# EAGLE design LoRa Node Module_V1.0 (EAGLE 9.6.2)
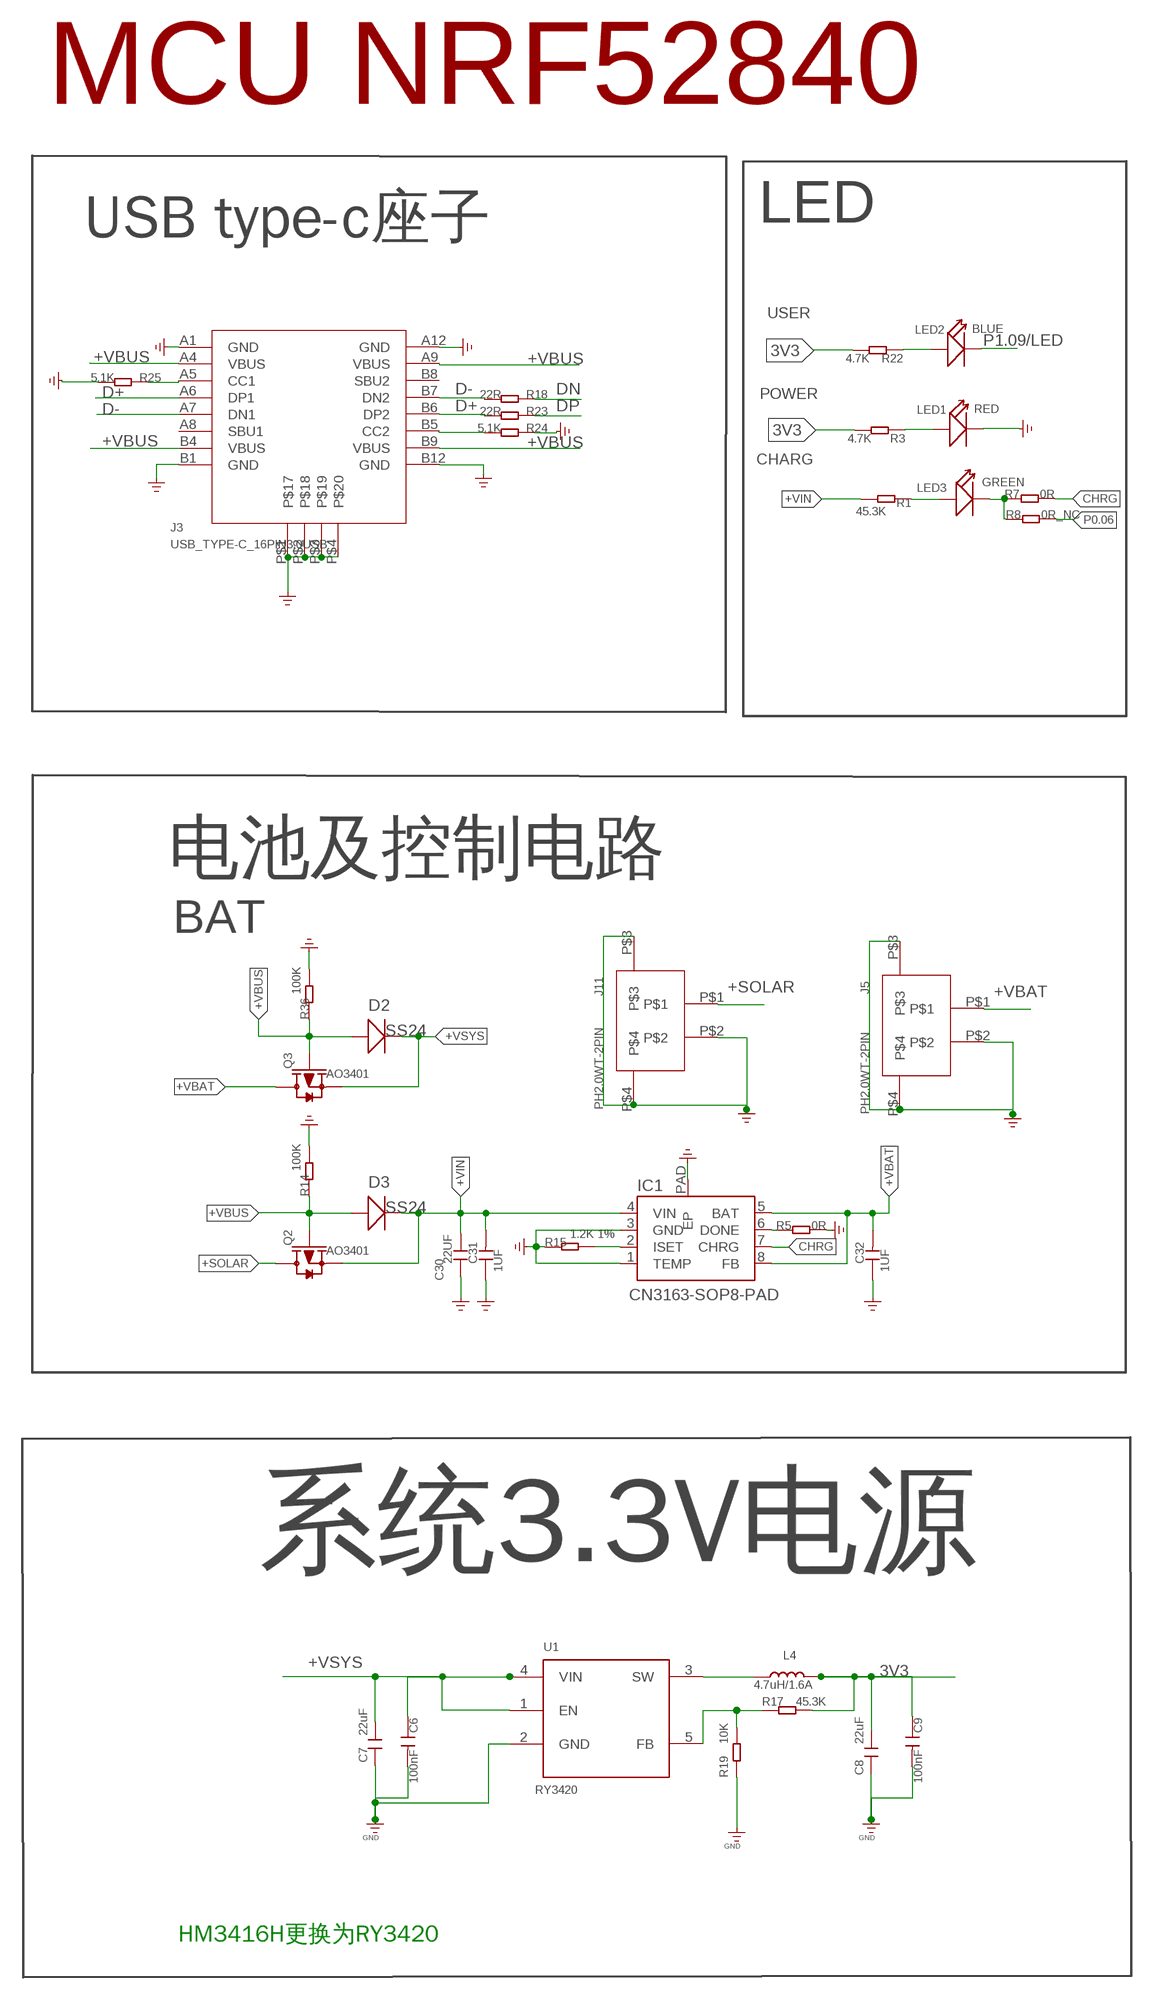
[diagram p0: schematic, sheet 1, part 1 of 2]
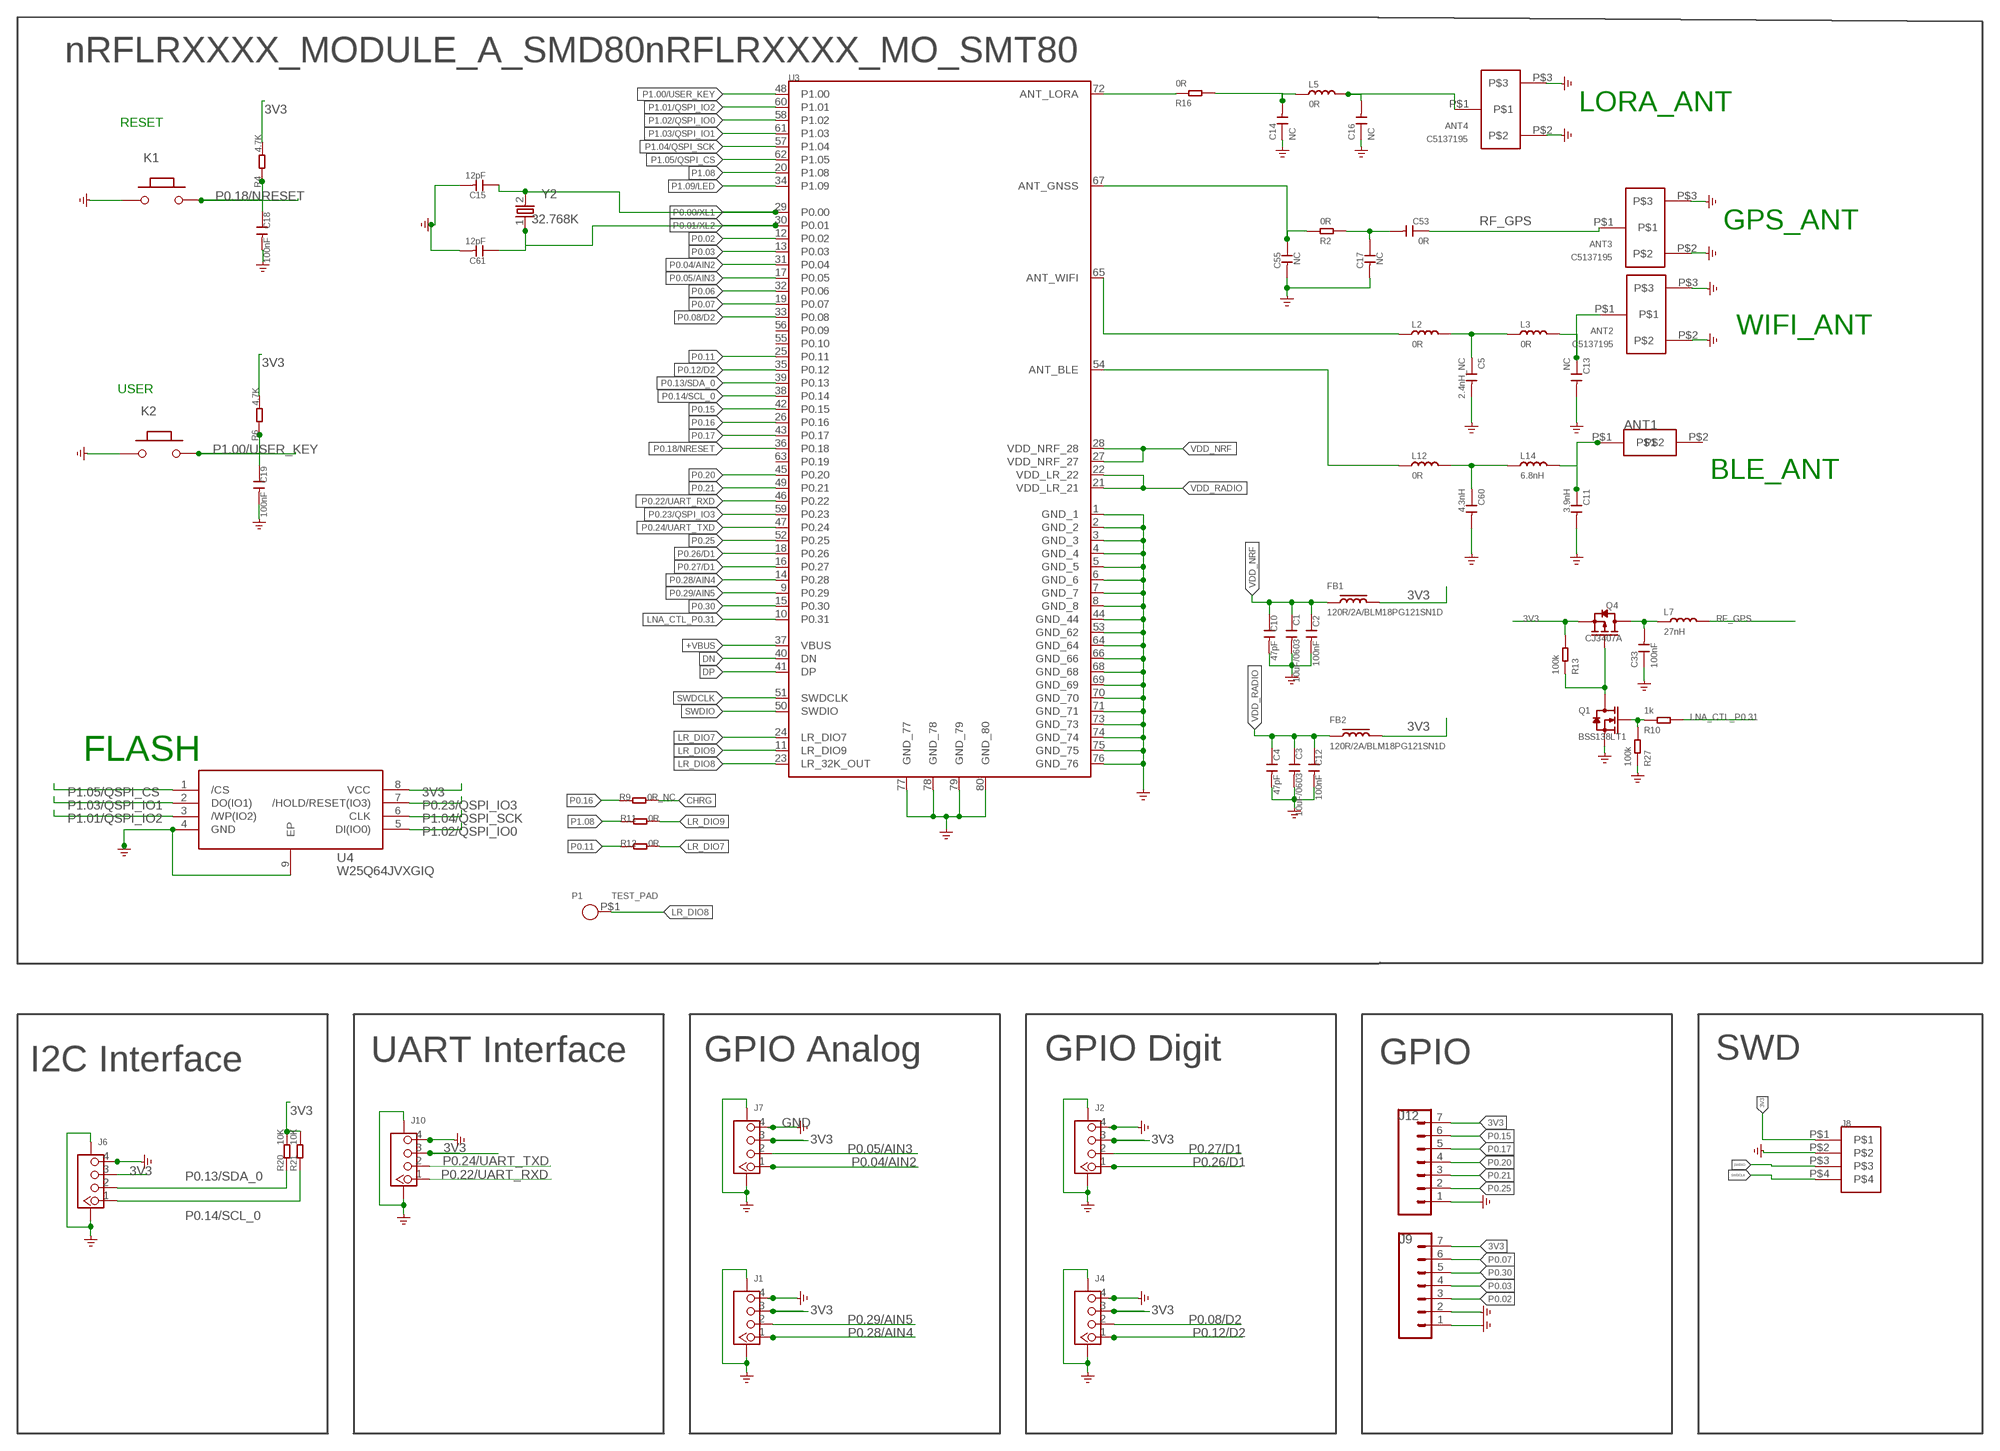
[diagram p1: schematic, sheet 1, part 2 of 2]

## Parts
ANT1  ANT2.4G_BLE  [2.4G_BLE]
ANT2  C5137195  MYSELF_IPEX  [MYSELF_IPEX1]
ANT3  C5137195  MYSELF_IPEX  [MYSELF_IPEX1]
ANT4  C5137195  MYSELF_IPEX  [MYSELF_IPEX1]
C1  10uF/0603  C0603  [C0603]
C2  100nF  CAPC0402-1  [C0402]
C3  10uF/0603  C0603  [C0603]
C4  47pF  CAPC0402-1  [C0402]
C5  2.4nH_NC  DISCRETE-NEW_CAP-0402  [DISCRETE-NEW_C0402]
C6  100nF  CAPC0402-1  [C0402]
C7  22uF  C0603  [0603]
C8  22uF  C0603  [0603]
C9  100nF  CAPC0402-1  [C0402]
C10  47pF  CAPC0402-1  [C0402]
C11  3.9nH  DISCRETE-NEW_CAP-0402  [DISCRETE-NEW_C0402]
C12  100nF  CAPC0402-1  [C0402]
C13  NC  DISCRETE-NEW_CAP-0402  [DISCRETE-NEW_C0402]
C14  NC  CAP-0402  [C0402]
C15  12pF  DISCRETE-NEW_CAP-0402  [DISCRETE-NEW_C0402]
C16  NC  CAP-0402  [C0402]
C17  NC  DISCRETE-NEW_CAP-0402  [DISCRETE-NEW_C0402]
C18  100nF  CAPC0402-1  [C0402]
C19  100nF  CAPC0402-1  [C0402]
C30  22UF  C0603  [0603]
C31  1UF  C0603  [C0603]
C32  1UF  C0603  [C0603]
C33  100nF  CAP-0402  [C0402]
C53  0R  DISCRETE-NEW_CAP-0402  [DISCRETE-NEW_C0402]
C55  NC  DISCRETE-NEW_CAP-0402  [DISCRETE-NEW_C0402]
C60  4.3nH  DISCRETE-NEW_CAP-0402  [DISCRETE-NEW_C0402]
C61  12pF  DISCRETE-NEW_CAP-0402  [DISCRETE-NEW_C0402]
D2  SS24  DIODEB130L-13-F  [SMA]
D3  SS24  DIODEB130L-13-F  [SMA]
FB1  120R/2A/BLM18PG121SN1D  FBL0603  [L0603]
FB2  120R/2A/BLM18PG121SN1D  FBL0603  [L0603]
IC1  CN3163-SOP8-PAD  [SOP8-PAD]
J1  CONNECTOR_TWIG-4P-2.0-SMD-FEMALE-REINFORCE90D  [CONNECTOR_4P-SMD-2.0-90D]
J2  CONNECTOR_TWIG-4P-2.0-SMD-FEMALE-REINFORCE90D  [CONNECTOR_4P-SMD-2.0-90D]
J3  USB_TYPE-C_16PIN3.0USB  [KEVIN_3.0TYPEC-SMD]
J4  CONNECTOR_TWIG-4P-2.0-SMD-FEMALE-REINFORCE90D  [CONNECTOR_4P-SMD-2.0-90D]
J5  PH2.0WT-2PIN  [PH2.0WT-2PIN]
J6  CONNECTOR_TWIG-4P-2.0-SMD-FEMALE-REINFORCE90D  [CONNECTOR_4P-SMD-2.0-90D]
J7  CONNECTOR_TWIG-4P-2.0-SMD-FEMALE-REINFORCE90D  [CONNECTOR_4P-SMD-2.0-90D]
J8  2.0MM-4P  [2.0MM-4P]
J9  CONN_07NO_SILK  [1X07_NO_SILK]
J10  CONNECTOR_TWIG-4P-2.0-SMD-FEMALE-REINFORCE90D  [CONNECTOR_4P-SMD-2.0-90D]
J11  PH2.0WT-2PIN  [PH2.0WT-2PIN]
J12  CONN_07NO_SILK  [1X07_NO_SILK]
K1  BUTTON  PB157  [157SW]
K2  BUTTON  PB157  [157SW]
L2  0R  XADOW-GPS-V2_DISCRETE-NEW_INDUCTOR/FERRITE-BEAD0402  [XADOW-GPS-V2_DISCRETE-NEW_L0402]
L3  0R  XADOW-GPS-V2_DISCRETE-NEW_INDUCTOR/FERRITE-BEAD0402  [XADOW-GPS-V2_DISCRETE-NEW_L0402]
L4  4.7uH/1.6A  A9G_DISCRETE_L0805  [A9G_DISCRETE_L0805]
L5  0R  INDUCTOR'0402'  [L0402]
L7  27nH  INDUCTOR'0402'  [L0402]
L12  0R  XADOW-GPS-V2_DISCRETE-NEW_INDUCTOR/FERRITE-BEAD0402  [XADOW-GPS-V2_DISCRETE-NEW_L0402]
L14  6.8nH  XADOW-GPS-V2_DISCRETE-NEW_INDUCTOR/FERRITE-BEAD0402  [XADOW-GPS-V2_DISCRETE-NEW_L0402]
LED1  RED  DISCRETE_LED0603  [DISCRETE_LED-0603]
LED2  BLUE  DISCRETE_LED0603  [DISCRETE_LED-0603]
LED3  GREEN  LED-SMT0603  [LED0603]
P1  TEST_PAD  TEST_PADPAD-1.5MM  [TEST_PAD-1.5MM]
Q1  BSS138LT1  MOSFET-N-SI1304BDL  [SOT-323]
Q2  AO3401  MOSFET-PSOT23  [PMOS_SOT23]
Q3  AO3401  MOSFET-PSOT23  [PMOS_SOT23]
Q4  CJ3407A  MOSFET-P-SOT323  [SOT-323]
R1  45.3K  RES-0402  [R0402]
R2  0R  DISCRETE-NEW_RES-0402  [DISCRETE-NEW_R0402]
R3  4.7K  R0402-1  [0402]
R4  4.7K  R0402-0402  [R0402]
R5  0R  RES-0402  [R0402]
R6  4.7K  R0402-0402  [R0402]
R7  0R  RES-0402  [R0402]
R8  0R_NC  RES-0402  [R0402]
R9  0R_NC  RES-0402  [R0402]
R10  1k  RES-0402  [R0402]
R11  0R  RES-0402  [R0402]
R12  0R  RES-0402  [R0402]
R13  100k  RES-0402  [R0402]
R14  100K  RES-0402  [R0402]
R15  1.2K 1%  RES-0402  [R0402]
R16  0R  DISCRETE-NEW_RES-0402  [DISCRETE-NEW_R0402]
R17  45.3K  R0402-1  [0402]
R18  22R  R0402-1  [0402]
R19  10K  R0402-1  [0402]
R20  10K  R0402-1  [0402]
R21  10K  R0402-1  [0402]
R22  4.7K  R0402-1  [0402]
R23  22R  R0402-1  [0402]
R24  5.1K  R0402-1  [0402]
R25  5.1K  R0402-1  [0402]
R27  100k  RES-0402  [R0402]
R36  100K  RES-0402  [R0402]
U1  RY3420  CROWBOT_-V1.0-20220525_A_XBJ_HM3420B  [CROWBOT_-V1.0-20220525_A_XBJ_SOT23-5]
U3  nRFLRXXXX_MODULE_A_SMD80nRFLRXXXX_MO_SMT80  LR11XX_MODULE_A_SMD80LR11XX_MO_SMT80  [LR11XX_MO_A_SMD80]
U4  W25Q64JVXGIQ  [XSON-EP(4×4)]
Y2  32.768K  NORDIC_NRF_XTAL_32KHZ  [NORDIC_NRF_XTAL_3215_N]

## Nets
3V3: C8.2 C9.1 FB1.2 FB2.2 J1.3 J2.3 J4.3 J6.3 J7.3 J8.P$1 J9.7 J10.3 J12.7 L4.2 Q4.2(S) R3.2 R4.2 R6.2 R13.2 R17.2 R20.2 R21.2 R22.2 U4.8(VCC)
+SOLAR: J11.P$1 Q2.3(D)
+VBAT: C32.2 IC1.5(BAT) IC1.8(FB) J5.P$1 Q3.3(D)
+VBUS: D2.2(+) D3.2(+) J3.A4(VBUS) J3.A9(VBUS) J3.B4(VBUS) J3.B9(VBUS) Q2.1(G) Q3.1(G) R14.1 R36.1 U3.37(VBUS)
+VIN: C30.2 C31.2 D3.1(-) IC1.4(VIN) Q2.2(S) R1.2
+VSYS: C6.1 C7.2 D2.1(-) Q3.2(S) U1.1(EN) U1.4(VIN)
CHRG: IC1.7(CHRG) R7.2 R9.2
D+: J3.A6(DP1) J3.B6(DP2) R23.2
D-: J3.A7(DN1) J3.B7(DN2) R18.2
DN: R18.1 U3.40(DN)
DP: R23.1 U3.41(DP)
GND: ANT2.P$2 ANT2.P$3 ANT3.P$2 ANT3.P$3 ANT4.P$2 ANT4.P$3 C1.2 C2.2 C3.2 C4.2 C5.2 C6.2 C7.1 C8.1 C9.2 C10.2 C11.2 C12.2 C13.2 C14.1 C15.2 C16.1 C17.2 C18.2 C19.2 C30.1 C31.1 C32.1 C33.1 C55.2 C60.2 C61.2 IC1.1(TEMP) IC1.3(GND) IC1.PAD(EP) J1.4 J1.SS1 J1.SS2 J2.4 J2.SS1 J2.SS2 J3.A1(GND) J3.A12(GND) J3.B1(GND) J3.B12(GND) J3.P$1 J3.P$2 J3.P$3 J3.P$4 J4.4 J4.SS1 J4.SS2 J5.P$2 J5.P$3 J5.P$4 J6.4 J6.SS1 J6.SS2 J7.4 J7.SS1 J7.SS2 J8.P$2 J9.1 J9.2 J10.4 J10.SS1 J10.SS2 J11.P$2 J11.P$3 J11.P$4 J12.1 K1.1 K2.1 LED1.- Q1.2(S) R5.2 R14.2 R15.1 R19.1 R24.1 R25.2 R27.1 R36.2 U1.2(GND) U3.1(GND_1) U3.2(GND_2) U3.3(GND_3) U3.4(GND_4) U3.5(GND_5) U3.6(GND_6) U3.7(GND_7) U3.8(GND_8) U3.44(GND_44) U3.53(GND_62) U3.64(GND_64) U3.66(GND_66) U3.68(GND_68) U3.69(GND_69) U3.70(GND_70) U3.71(GND_71) U3.73(GND_73) U3.74(GND_74) U3.75(GND_75) U3.76(GND_76) U3.77(GND_77) U3.78(GND_78) U3.79(GND_79) U3.80(GND_80) U4.4(GND) U4.9(EP) ; supply symbol labelled GND_POWER
LNA_CTL_P0.31: R10.2 U3.10(P0.31)
LR_DIO7: R12.2 U3.24(LR_DIO7)
LR_DIO8: P1.P$1 U3.23(LR_32K_OUT)
LR_DIO9: R11.2 U3.11(LR_DIO9)
N$1: LED2.+ R22.1
N$2: L12.1 U3.54(ANT_BLE)
N$3: C5.1 L2.2 L3.1
N$4: ANT2.P$1 C13.1 L3.2
N$5: L2.1 U3.65(ANT_WIFI)
N$6: J3.B5(CC2) R24.2
N$7: LED3.- R7.1 R8.1
N$8: C55.1 R2.1 U3.67(ANT_GNSS)
N$9: R16.1 U3.72(ANT_LORA)
N$10: LED1.+ R3.1
N$11: LED3.+ R1.1
N$12: J3.A5(CC1) R25.1
N$13: L4.1 U1.3(SW)
N$14: C14.2 L5.1 R16.2
N$15: IC1.2(ISET) R15.2
N$16: ANT4.P$1 C16.2 L5.2
N$17: Q1.3(D) Q4.1(G) R13.1
N$18: Q1.1(G) R10.1 R27.2
N$19: IC1.6(DONE) R5.1
N$20: R17.1 R19.2 U1.5(FB)
N$27: C33.2 L7.1 Q4.3(D)
N$54: C17.1 C53.2 R2.2
N$63: C60.1 L12.2 L14.1
N$104: ANT1.P$1 C11.1 L14.2
P0.00/XL1: C15.1 U3.29(P0.00) Y2.2
P0.01/XL2: C61.1 U3.30(P0.01) Y2.1
P0.02: J9.3 U3.12(P0.02)
P0.03: J9.4 U3.13(P0.03)
P0.04/AIN2: J7.1 U3.31(P0.04)
P0.05/AIN3: J7.2 U3.17(P0.05)
P0.06: R8.2 U3.32(P0.06)
P0.07: J9.6 U3.19(P0.07)
P0.08/D2: J4.2 U3.33(P0.08)
P0.11: R12.1 U3.25(P0.11)
P0.12/D2: J4.1 U3.35(P0.12)
P0.13/SDA_0: J6.2 R20.1 U3.39(P0.13)
P0.14/SCL_0: J6.1 R21.1 U3.38(P0.14)
P0.15: J12.6 U3.42(P0.15)
P0.16: R9.1 U3.26(P0.16)
P0.17: J12.5 U3.43(P0.17)
P0.18/NRESET: C18.1 K1.2 R4.1 U3.36(P0.18)
P0.20: J12.4 U3.45(P0.20)
P0.21: J12.3 U3.49(P0.21)
P0.22/UART_RXD: J10.1 U3.46(P0.22)
P0.23/QSPI_IO3: U3.59(P0.23) U4.7(/HOLD/RESET(IO3))
P0.24/UART_TXD: J10.2 U3.47(P0.24)
P0.25: J12.2 U3.52(P0.25)
P0.26/D1: J2.1 U3.18(P0.26)
P0.27/D1: J2.2 U3.16(P0.27)
P0.28/AIN4: J1.1 U3.14(P0.28)
P0.29/AIN5: J1.2 U3.9(P0.29)
P0.30: J9.5 U3.15(P0.30)
P1.00/USER_KEY: C19.1 K2.2 R6.1 U3.48(P1.00)
P1.01/QSPI_IO2: U3.60(P1.01) U4.3(/WP(IO2))
P1.02/QSPI_IO0: U3.58(P1.02) U4.5(DI(IO0))
P1.03/QSPI_IO1: U3.61(P1.03) U4.2(DO(IO1))
P1.04/QSPI_SCK: U3.57(P1.04) U4.6(CLK)
P1.05/QSPI_CS: U3.62(P1.05) U4.1(/CS)
P1.08: R11.1 U3.20(P1.08)
P1.09/LED: LED2.- U3.34(P1.09)
RF_GPS: ANT3.P$1 C53.1 L7.2
SWDCLK: J8.P$4 U3.51(SWDCLK)
SWDIO: J8.P$3 U3.50(SWDIO)
VDD_NRF: C1.1 C2.1 C10.1 FB1.1 U3.27(VDD_NRF_27) U3.28(VDD_NRF_28)
VDD_RADIO: C3.1 C4.1 C12.1 FB2.1 U3.21(VDD_LR_21) U3.22(VDD_LR_22)
Unconnected: ANT1.P$2 J3.A8(SBU1) J3.B8(SBU2) U3.55(P0.10) U3.56(P0.09) U3.63(P0.19)

## Notes on the sheet
- MCU NRF52840
- USB type-c座子 | LED
- LORA_ANT
- RESET
- USER
- POWER
- GPS_ANT
- CHARG
- WIFI_ANT
- USER
- BLE_ANT
- 电池及控制电路
- BAT
- FLASH
- UART Interface | GPIO Analog | GPIO Digit | GPIO | SWD
- I2C Interface
- 系统3.3V电源
- HM3416H更换为RY3420

## Library data of the parts
ANT1 = myself:ANT
ANT2-ANT4 = NBIOT:MYSELF_IPEX
C1 C3 = Lora_Basic_Gateway_ Module:C0603
C2 C4 C6 C9 C10 C12 C18 C19 = SX1302_Module:CAP*
C5 C11 C13 C15 C17 C53 C55 C60 C61 = Xadow-GPS-v2:DISCRETE-NEW_CAP: Ceramic Capacitors
C7 C8 = WGH:C0603
C14 C16 C33 = Discrete-new:CAP: Ceramic Capacitors
C30 = RC:C0603
C31 C32 = Lora_RA-08H_Node_ Board:C0603
D2 D3 = Lora_RA-08H_Node_ Board:DIODE*
FB1 FB2 = LoraWAN_Gateway_Mainboard:FB*
IC1 = Lora_RA-08H_Node_ Board:CN3163-SOP8-PAD
J1 J2 J4 J6 J7 J10 = A_xbj:CONNECTOR_TWIG-4P-2.0-SMD-FEMALE-REINFORCE
J3 = SparkFun-Connectors:USB_TYPE-C_16PIN
J5 J11 = cooper:PH2.0WT-2PIN
J8 = myself:2.0MM-4P
J9 J12 = SparkFun-Connectors:CONN_07: Multi connection point. Often used as Generic Header-pin footprint for 0.1 inch spaced/style header connections On any of the 0.1 inch spaced packages, you can populate with these: Break Away Headers - Straight <https://www.sparkfun.com/products/116> (PRT-00116) Break Away Male Headers - Right Angle <https://www.sparkfun.com/products/553> (PRT-00553) Female Headers <https://www.sparkfun.com/products/115> (PRT-00115) Break Away Headers - Machine Pin <https://www.sparkfun.com/products/117> (PRT-00117) Break Away Female Headers - Swiss Machine Pin <https://www.sparkfun.com/products/743> (PRT-00743) For SCREWTERMINALS and SPRING TERMINALS visit here: Screw Terimnals on SparkFun.com <https://www.sparkfun.com/search/results?term=Screw+Terminals> (5mm/3.5mm/2.54mm spacing) This device is also useful as a general connection point to wire up your design to another part of your project. Our various solder wires solder well into these plated through hole pads. Hook-Up Wire - Assortment (Stranded, 22 AWG) <https://www.sparkfun.com/products/11375> (PRT-11375) Hook-Up Wire - Assortment (Solid Core, 22 AWG) <https://www.sparkfun.com/products/11367> (PRT-11367) View the entire wire category on our website here <https://www.sparkfun.com/categories/141> Special notes: Molex polarized connector foot print use with SKU : PRT-08231 with associated crimp pins and housings. 1MM SMD Version SKU: PRT-10208 NOTES ON THE VARIANTS LOCK and LOCK_LONGPADS... This footprint was designed to help hold the alignment of a through-hole component (i.e. 6-pin header) while soldering it into place. You may notice that each hole has been shifted either up or down by 0.005 of an inch from it's more standard position (which is a perfectly straight line). This slight alteration caused the pins (the squares in the middle) to touch the edges of the holes. Because they are alternating, it causes a "brace" to hold the component in place. 0.005 has proven to be the perfect amount of "off-center" position when using our standard breakaway headers. Although looks a little odd when you look at the bare footprint, once you have a header in there, the alteration is very hard to notice. Also,if you push a header all the way into place, it is covered up entirely on the bottom side.
K1 K2 = MySMD:PB157
L2 L3 L12 L14 = 2401:XADOW-GPS-V2_DISCRETE-NEW_INDUCTOR/FERRITE-BEAD
L4 = ESP32-S3 4.2“ EINK V1.3:A9G_DISCRETE_L*
L5 L7 = Discrete-new:INDUCTOR
LED1 LED2 = A_xbj:DISCRETE_LED*
LED3 = Lora_RA-08H_Node_ Board:LED-SMT*
P1 = A7670X_4G_PCIE:TEST_PAD*
Q1 = Discrete-new:MOSFET-N: IRLL014: http://www.vishay.com/docs/91319/sihll014.pdf
Q2 Q3 = Lora_RA-08H_Node_ Board:MOSFET-P: IRLL014: http://www.vishay.com/docs/91319/sihll014.pdf
Q4 = Discrete-new:MOSFET-P
R1 R14 R15 R36 = Lora_RA-08H_Node_ Board:RES*
R2 R16 = Xadow-GPS-v2:DISCRETE-NEW_RES
R3 R17-R25 = WGH:R0402-1
R4 R6 = RC:R0402
R5 R7-R9 R11 R12 = LoraWAN_Gateway_Mainboard:RES*
R10 R13 R27 = Discrete-new:RES
U1 = CrowPanel ESP32 Display-4.3-inch-V2.1-20240314:CROWBOT_-V1.0-20220525_A_XBJ_HM3420B
U3 = LORA_LR1110:LR11XX_MODULE_A_SMD80
U4 = ESP32-S3 4.2“ EINK V1.3:W25Q64JVXGIQ
Y2 = nRF52832_MCU:NORDIC_NRF_XTAL_32KHZ

## Net classes
1 50ohm: width 0.156 mm, drill 0.203 mm, clearance 0.469 mm

## Board
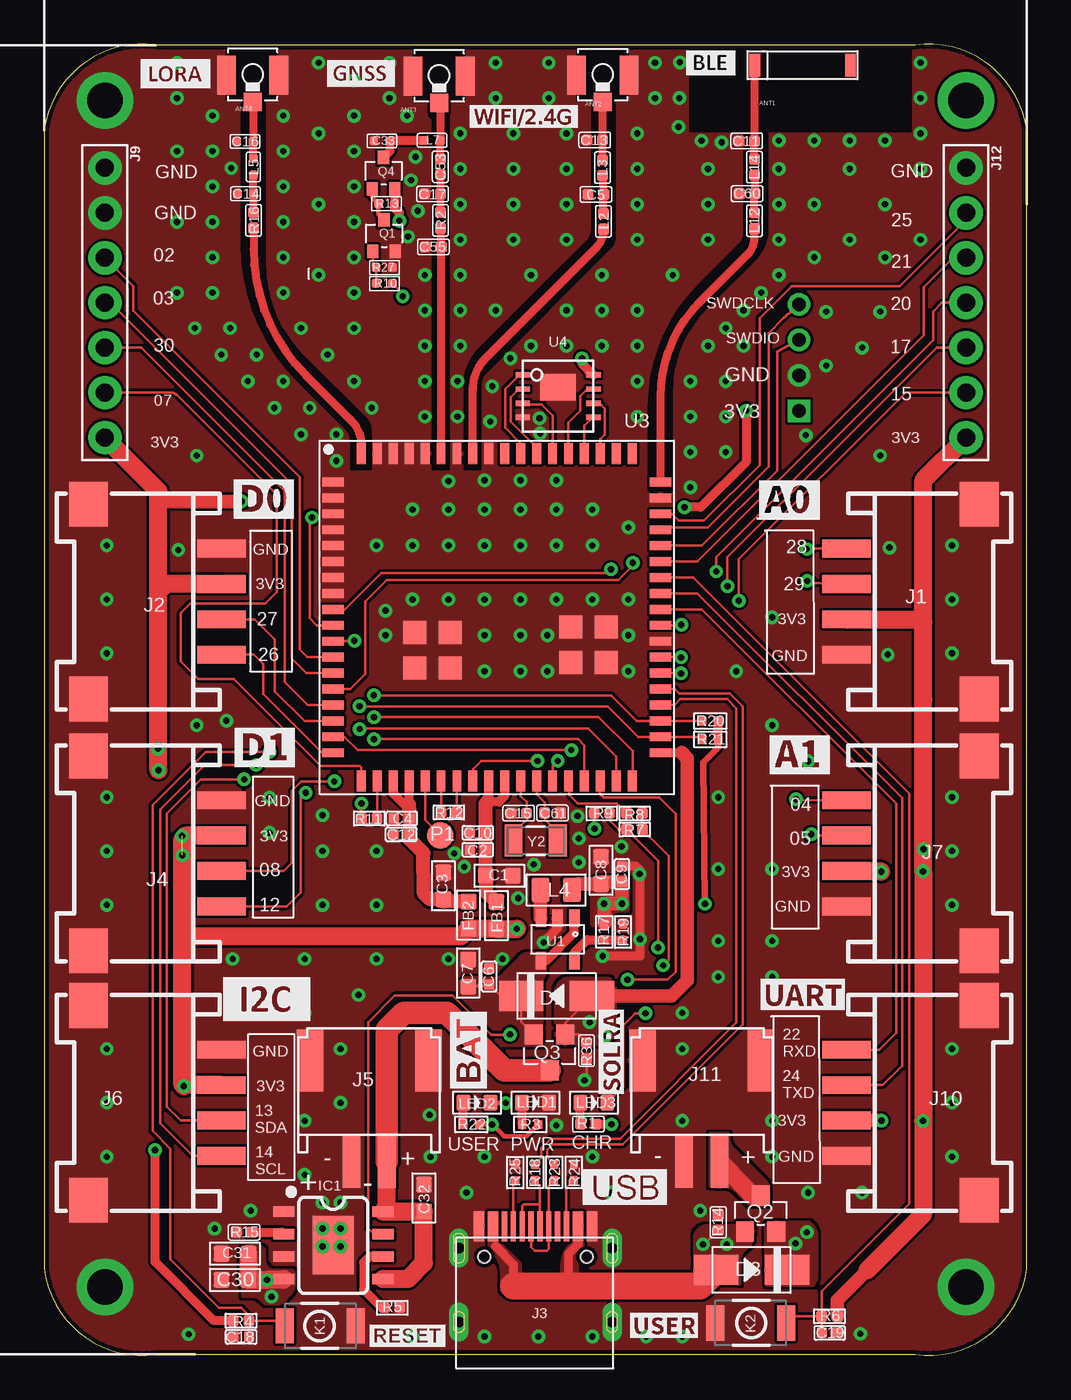
[diagram p2: board, top side]
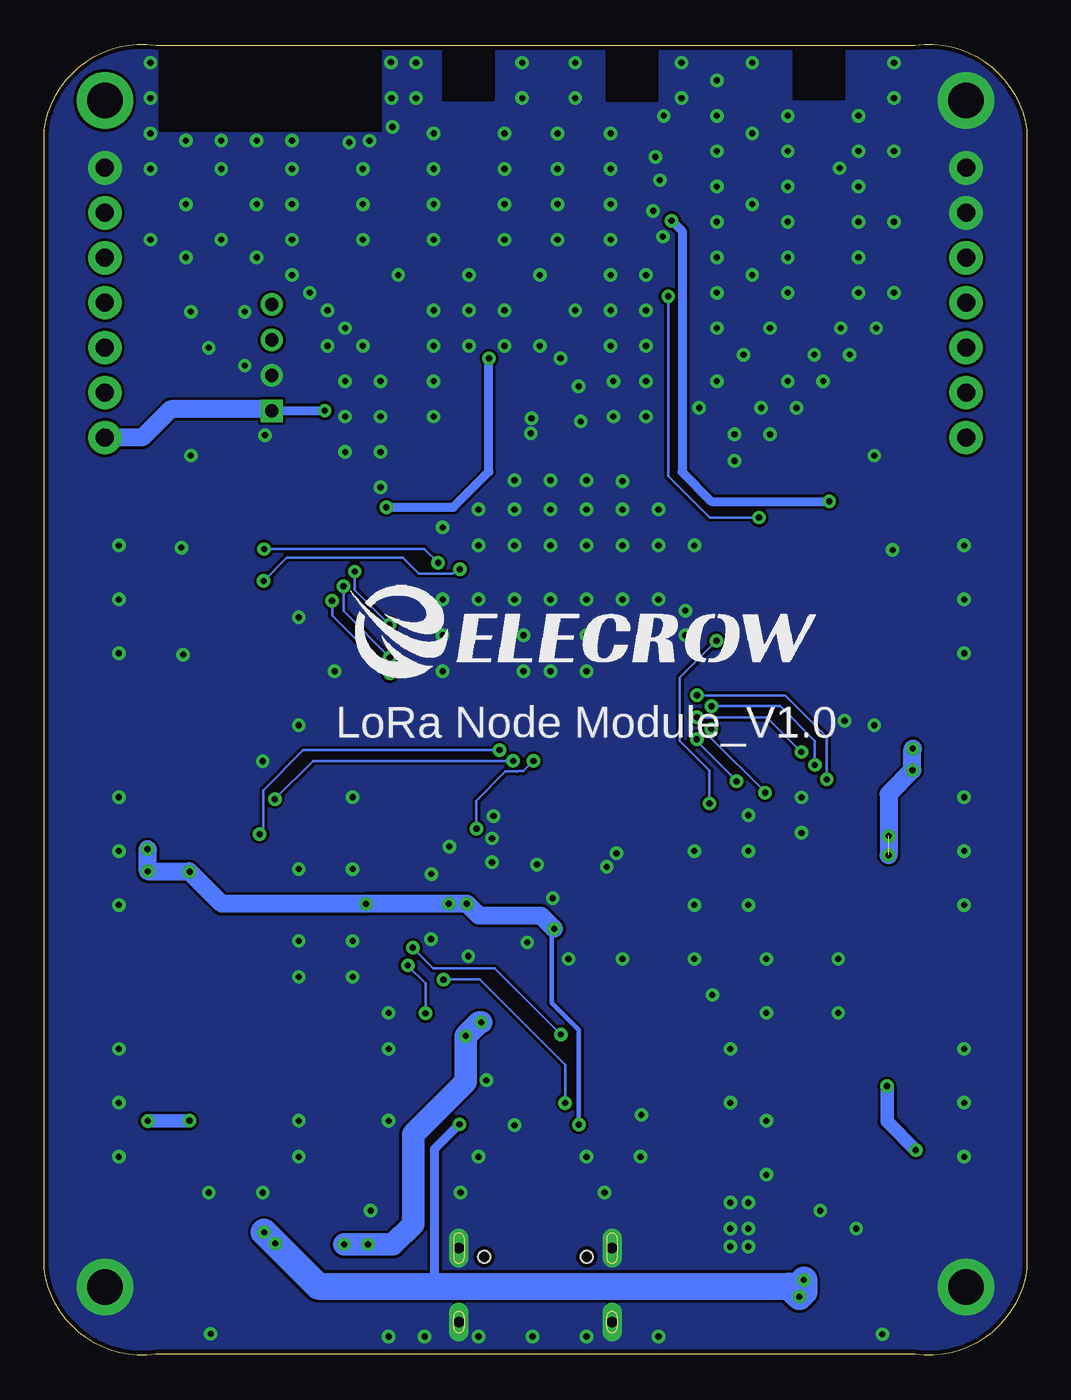
[diagram p3: board, bottom side, seen from below]

Size 55.5 x 74.09 mm. Coordinates in mm from the lower left corner, seen from the top.
Outline: 55.5,4.85 55.5,69.25 arc90 49.2,74.05 6.3,74.05 arc90 0,69.25 0,4.85 arc90 6.3,0.05 49.2,0.05 arc90 55.5,4.85
Copper layers (1*16): Top 0.035mm / dielectric 1.5mm / Bottom 0.035mm
Design rules "default *": minimum track width 6mil, minimum drill 0.35mm, track to track 6mil, track to pad 6mil, pad to pad 6mil, via to via 6mil, smd to smd 6mil, copper to edge 10mil, drill to drill 6mil, minimum pad ring 10mil, minimum via ring 8mil, stop-mask expansion 4mil, vias tented up to drill 50mil, thermal gap 0mil

### Footprints (pad centres in the part's own frame; a part is rotated, then mirrored left to right if it is on the bottom)
2.4G_BLE = smd 0.6 x 1.3: P$1 0,0; P$2 5.4,0
MYSELF_IPEX1 = smd 1.05 x 1: P$1 0,0 | smd 2.2 x 1.05: P$2 1.525,-1.475; P$3 1.525,1.475
C0603 = smd 0.889 x 0.889: 1 -0.762,0; 2 0.762,0
C0402 = smd 0.6 x 0.6: 1 -0.45,0; 2 0.45,0
DISCRETE-NEW_C0402 = smd 0.635 x 0.635: 1 0,0.445; 2 0,-0.445
0603 = smd 0.889 x 0.889: 1 -0.762,0; 2 0.762,0
C0402' = smd 0.5 x 0.5: 1 -0.463,0; 2 0.463,0
SMA = smd 2.5 x 1.7: 1 2,0; 2 -2,0
L0603 = smd 0.889 x 0.889: 1 -0.762,0; 2 0.762,0
SOP8-PAD = smd 0.6 x 1.2: 1 -1.905,-2.8; 2 -0.635,-2.8; 3 0.635,-2.8; 4 1.905,-2.8; 5 1.905,2.8; 6 0.635,2.8; 7 -0.635,2.8; 8 -1.905,2.8 | smd 3.3 x 2.311: PAD 0,0
CONNECTOR_4P-SMD-2.0-90D = smd 1.01 x 2.74: 1 -3,-0.1; 2 -1,-0.1; 3 1,-0.1; 4 3,-0.1 | smd 2.54 x 2.184: SS1 -5.5,7.4; SS2 5.5,7.4
KEVIN_3.0TYPEC-SMD = smd 0.3 x 1.7: A1 -3.35,0.5; A4 -2.55,0.5; A5 -1.25,0.5; A6 -0.25,0.5; A7 0.25,0.5; A8 1.25,0.5; A9 2.55,0.5; A12 3.35,0.5; B1 3.05,0.5; B4 2.25,0.5; B5 1.75,0.5; B6 0.75,0.5; B7 -0.75,0.5; B8 -1.75,0.5; B9 -2.25,0.5; B12 -3.05,0.5 | drill 0.6 pad 1.016 long: P$1 -4.325,-0.72; P$2 4.325,-0.72; P$3 -4.325,-4.9; P$4 4.325,-4.9 | hole 0.68: -2.89,-1.22; 2.89,-1.22
PH2.0WT-2PIN = smd 1 x 3: P$1 -1,0; P$2 1,0 | smd 1.5 x 3.5: P$3 -3.35,-5.7; P$4 3.35,-5.7
2.0MM-4P = drill 0.762 pad 1.27 square: P$1 0,0 | drill 0.762 pad 1.27: P$2 2,0; P$3 4,0; P$4 6,0
1X07_NO_SILK = drill 1.016 pad 1.88: 1 0,0; 2 2.54,0; 3 5.08,0; 4 7.62,0; 5 10.16,0; 6 12.7,0; 7 15.24,0
157SW = smd 1.016 x 1.981: 1 0,0; 2 4,0
XADOW-GPS-V2_DISCRETE-NEW_L0402 = smd 0.635 x 0.635: 1 -0.445,0; 2 0.445,0
A9G_DISCRETE_L0805 = smd 1.016 x 1.397: 1 -0.889,0; 2 0.889,0
L0402 = smd 0.5 x 0.5: 1 -0.463,0; 2 0.463,0
DISCRETE_LED-0603 = smd 0.762 x 0.889: + -0.762,0; - 0.762,0
LED0603 = smd 0.762 x 0.889: + -0.762,0; - 0.762,0
TEST_PAD-1.5MM = smd 1.5 x 1.5: P$1 0,0
SOT-323 = smd 0.762 x 0.635: 1 0.889,-0.635; 2 0.889,0.635; 3 -0.889,0
PMOS_SOT23 = smd 1.016 x 1.143: 1 -0.889,-1.016; 2 0.889,-1.016; 3 0,1.016
R0402 = smd 0.635 x 0.635: 1 -0.445,0; 2 0.445,0
DISCRETE-NEW_R0402 = smd 0.635 x 0.635: 1 0,0.445; 2 0,-0.445
0402 = smd 0.5 x 0.5: 1 -0.45,0; 2 0.45,0
R0402' = smd 0.5 x 0.5: 1 -0.463,0; 2 0.463,0
CROWBOT_-V1.0-20220525_A_XBJ_SOT23-5 = smd 0.6 x 1: 1 -0.95,-1.2; 2 0,-1.2; 3 0.95,-1.2; 4 0.95,1.2; 5 -0.95,1.2
LR11XX_MO_A_SMD80 = smd 1.2 x 0.5: 1 -9.25,7.65; 2 -9.25,6.75; 3 -9.25,5.85; 4 -9.25,4.95; 5 -9.25,4.05; 6 -9.25,3.15; 7 -9.25,2.25; 8 -9.25,1.35; 9 -9.25,0.45; 10 -9.25,-0.45; 11 -9.25,-1.35; 12 -9.25,-2.25; 13 -9.25,-3.15; 14 -9.25,-4.05; 15 -9.25,-4.95; 16 -9.25,-5.85; 17 -9.25,-6.75; 18 -9.25,-7.65; 37 9.25,-7.65; 38 9.25,-6.75; 39 9.25,-5.85; 40 9.25,-4.95; 41 9.25,-4.05; 42 9.25,-3.15; 43 9.25,-2.25; 44 9.25,-1.35; 45 9.25,-0.45; 46 9.25,0.45; 47 9.25,1.35; 48 9.25,2.25; 49 9.25,3.15; 50 9.25,4.05; 51 9.25,4.95; 52 9.25,5.85; 53 9.25,6.75; 54 9.25,7.65 | smd 0.5 x 1.2: 19 -7.65,-9.25; 20 -6.75,-9.25; 21 -5.85,-9.25; 22 -4.95,-9.25; 23 -4.05,-9.25; 24 -3.15,-9.25; 25 -2.25,-9.25; 26 -1.35,-9.25; 27 -0.45,-9.25; 28 0.45,-9.25; 29 1.35,-9.25; 30 2.25,-9.25; 31 3.15,-9.25; 32 4.05,-9.25; 33 4.95,-9.25; 34 5.85,-9.25; 35 6.75,-9.25; 36 7.65,-9.25; 55 7.65,9.25; 56 6.75,9.25; 57 5.85,9.25; 58 4.95,9.25; 59 4.05,9.25; 60 3.15,9.25; 61 2.25,9.25; 62 1.35,9.25; 63 0.45,9.25; 64 -0.45,9.25; 65 -1.35,9.25; 66 -2.25,9.25; 67 -3.15,9.25; 68 -4.05,9.25; 69 -4.95,9.25; 70 -5.85,9.25; 71 -6.75,9.25; 72 -7.65,9.25 | smd 1.3 x 1.3: 73 -4.64,-0.86; 74 -2.64,-0.86; 75 -4.64,-2.86; 76 -2.64,-2.86; 77 4.18,-0.54; 78 6.18,-0.54; 79 4.18,-2.54; 80 6.18,-2.54
XSON-EP(4×4) = smd 0.8 x 0.3: 1 -2,1.2; 2 -2,0.4; 3 -2,-0.4; 4 -2,-1.2; 5 2,-1.2; 6 2,-0.4; 7 2,0.4; 8 2,1.2 | smd 2 x 1.5: 9 0,0.5
NORDIC_NRF_XTAL_3215_N = smd 1 x 1.8: 1 -1.25,0; 2 1.25,0

### Placement (x,y rotation side)
ANT1  40.14,72.91 0 top
ANT2  31.55,70.82 90 top
ANT3  22.31,70.77 90 top
ANT4  11.77,70.83 90 top
C1  25.71,27.1 0 top
C2  24.49,28.57 180 top
C3  22.55,26.53 90 top
C4  20.19,30.34 180 top
C5  31.17,65.6 270 top
C6  25.13,21.4 90 top
C7  23.95,21.6 270 top
C8  31.46,27.41 270 top
C9  32.63,27.19 90 top
C10  24.49,29.53 180 top
C11  39.68,68.62 270 top
C12  20.16,29.44 180 top
C13  31.1,68.68 270 top
C14  NC  [C0402']  11.37,65.64 0 top
C15  26.8,30.63 270 top
C16  NC  [C0402']  11.34,68.6 0 top
C17  21.93,65.63 270 top
C18  11.13,1.04 180 top
C19  44.38,1.26 0 top
C30  10.77,4.26 0 top
C31  10.77,5.74 0 top
C32  21.45,8.88 270 top
C33  100nF  [C0402']  19.08,68.63 0 top
C53  22.37,67.17 0 top
C55  21.98,62.64 270 top
C60  39.71,65.64 270 top
C61  28.71,30.64 90 top
D2  28.94,20.3 180 top
D3  39.96,4.82 0 top
FB1  25.54,24.85 270 top
FB2  23.97,24.87 270 top
IC1  16.33,6.22 270 top
J1  45.42,42.59 270 top
J2  9.91,42.59 90 top
J3  27.75,6.78 0 top
J4  9.91,28.37 90 top
J5  18.35,10.97 180 top
J6  9.91,14.27 90 top
J7  45.42,28.37 270 top
J8  42.65,53.39 90 top
J9  3.43,67.1 270 top
J10  45.42,14.27 270 top
J11  37.15,10.97 180 top
J12  52.07,67.1 270 top
K1  17.59,1.66 180 top
K2  37.91,1.82 0 top
L2  31.59,64.09 90 top
L3  31.53,67.12 90 top
L4  28.92,26.29 0 top
L5  11.81,67.16 90 top
L7  21.91,68.66 0 top
L12  40.12,64.11 90 top
L14  40.12,67.15 90 top
LED1  27.75,14.27 0 top
LED2  24.45,14.27 0 top
LED3  31.05,14.27 0 top
P1  22.37,29.39 0 top
Q1  19.2,63.26 270 top
Q2  40.48,8.01 0 top
Q3  28.55,17.11 180 top
Q4  19.17,66.81 270 top
R1  30.74,13.06 0 top
R2  22.38,64.14 180 top
R3  27.45,13.04 0 top
R4  11.11,1.95 180 top
R5  19.66,2.69 0 top
R6  44.36,2.2 0 top
R7  33.35,29.71 180 top
R8  33.35,30.63 180 top
R9  31.5,30.63 0 top
R10  1k  [R0402']  19.21,60.56 0 top
R11  18.36,30.34 180 top
R12  22.86,30.68 180 top
R13  100k  [R0402']  19.34,65.07 0 top
R14  38.08,7.51 90 top
R15  11.29,6.95 0 top
R16  11.83,64.14 180 top
R17  31.64,23.93 90 top
R18  27.73,10.34 270 top
R19  32.7,23.92 270 top
R20  37.63,35.84 0 top
R21  37.62,34.8 0 top
R22  24.13,13.04 0 top
R23  28.81,10.34 270 top
R24  29.92,10.34 270 top
R25  26.61,10.32 90 top
R27  100k  [R0402']  19.21,61.48 180 top
R36  30.63,17.22 270 top
U1  29,23.5 180 top
U3  25.57,41.7 0 top
U4  29.03,54.2 0 top
Y2  27.76,29.09 180 top

### Tracks (layer width: path | path; a pad name or v marks a point on that pad's centre or on a via)
3V3  (via drill 0.35)  (1 unrouted)
  Top 0.254: R3.2 27.23,12.36 25.97,12.36 v25.3,13.04 R22.2
  Top 0.381: R21.2 38.07,34.35 37.22,33.49 v37.32,25.51
  Top 0.5: U4.8 30.38,56.05 v30.38,56.34
  Top 0.508: v20.06,64.11 v20.06,64.12 20.06,64.56 19.8,64.82 R13.2 Q4.2 | R4.2 9.58,1.95 6.26,5.27 v6.26,11.59 | R21.2 R20.2 | v39.65,53.39 39.65,50.49 37.09,47.93 v36.17,47.93 | 32.63,25.52 v32.64,25.52
  Top 0.762: L4.2 30.16,26.64 C8.2 31.55,26.74 C9.1 32.63,25.52 v31.62,25.52 31.64,25.51 R17.2 | 49.67,40.63 49.67,37.08 | 46.51,4.82 44.81,3.12 R6.2 | J10.3 v47.29,13.27 v47.3,13.27 | v11.15,48.25 7.03,48.25 6.45,48.83
  Top 1.016: v26.7,24.1 v26.69,24.09 FB1.2 25.52,24.11 FB2.2 23.54,23.68 7.8,23.68 | J7.3 47.24,27.37 v47.28,27.33 | v6.45,33.07 6.45,43.17 | 6.45,43.17 6.88,43.61 9.99,43.61 J2.3 | 6.45,43.17 6.45,48.83 J9.7 | 46.51,4.82 49.65,7.96 v49.65,13.24 v49.65,27.35 49.65,28.57 v49.67,28.6 49.67,37.08 49.67,41.42 | 49.67,41.42 49.67,49.46 J12.7 | J1.3 49.5,41.59 49.67,41.42 | J6.3 7.95,15.27 v7.89,15.21 7.8,15.3 7.8,23.68 | 7.8,23.68 v7.8,28.26 7.8,29.17 7.99,29.37 J4.3
  Bottom 0.254: v25.3,13.04 25.3,18.39 26.84,19.92 26.84,23.96 v26.7,24.1
  Bottom 0.5: v36.17,47.93 32.39,47.93 30.38,49.93 v30.38,56.34
  Bottom 0.508: v20.06,64.11 19.47,63.52 19.47,49.91 17.81,48.25 v11.15,48.25 | J8.P$1 v39.65,53.39
  Bottom 0.762: v7.89,15.21 7.89,13.22 v6.26,11.59 | v49.65,13.24 47.32,13.24 v47.3,13.27
  Bottom 1.016: v26.7,24.1 27.45,24.85 30.95,24.85 v31.62,25.52 v32.64,25.52 37.21,25.52 v37.32,25.51 45.47,25.51 v47.28,27.33 47.31,27.35 v49.65,27.35 49.65,28.57 v49.67,28.6 | v6.43,34.28 6.45,34.26 v6.45,33.07 7.8,31.72 v7.8,28.26 | J8.P$1 43.02,53.39 43.1,53.47 48.36,53.47 49.97,51.86 J12.7
  other vias: 7.79,29.34
  pour Top: 31.23,24.24 32.02,24.24 32.12,24.34 arc45 32.13,24.37 32.13,24.81 arc-45 32.2,24.96 arc-45 32.41,25.05 32.67,25.05 32.87,25.05 32.95,25.05 arc45 33.06,25.33 33.06,25.53 33.06,26.79 arc45 32.97,27.01 arc45 32.79,27.08 32.36,27.08 31.38,27.08 arc45 31.04,26.94 arc45 30.88,26.55 30.88,24.37 arc45 30.9,24.3 30.95,24.25 arc45 30.98,24.24 31.22,24.24
+SOLAR
  Top 1.016: J11.P$1 40,9.02 Q2.3
  pour Top: 37.73,9.46 38.55,9.46 arc-45 39.09,9.23 39.24,9.08 39.83,8.49 arc45 39.94,8.44 40.8,8.44 arc45 40.98,8.52 40.98,9.36 arc45 40.76,9.9 39.84,10.82 38.95,11.7 38.95,11.71 arc-45 38.72,12.25 38.72,12.43 38.72,12.45 arc45 38.69,12.54 arc45 38.59,12.58 37.89,12.58 37.7,12.58 arc45 37.58,12.53 arc45 37.56,12.47 37.56,12.39 37.56,9.63 arc45 37.62,9.48 arc45 37.68,9.46 37.72,9.46
+VBAT
  Top 1.016: J5.P$1 19.32,10.95 19.32,8.31 IC1.8 C32.2 21.45,5.21 20.55,4.31 IC1.5
  Top 1.27: J5.P$1 19.35,18.39 20.31,19.34 22.75,19.34 26,16.1 Q3.3
+VBUS  (via drill 0.35)
  Top 0.152: D2.2 29.44,18.8 Q3.1 30.16,18.13 R36.1 | R14.1 37.28,6.27 v37.21,6.27 | J3.A4 J3.B9 25.5,6.14 | 30.17,6.29 30.17,7.15 J3.A9 J3.B4
  Top 0.508: U3.37 36.01,34.05 | 30.17,6.29 29.61,5.73 29.61,3.92 | 26.51,3.92 26.51,5.14 25.5,6.14
  Top 0.762: D2.2 35.46,20.3 36.34,21.18 36.34,33.72 36.01,34.05
  Top 1.524: D3.2 37.05,3.92 29.64,3.92 | 26.51,3.92 29.61,3.92
  Bottom 1.27: v38.56,6.27 v37.21,6.27 35.8,6.27 34.66,7.41 34.66,12.49 31.69,15.46 v31.69,18.04 30.91,18.82 v30.81,18.82
  pour Top: 28.98,17.53 31.4,17.53 arc45 31.94,17.76 32.17,17.99 arc45 32.27,18.24 32.27,19.86 32.27,20.78 arc45 32.11,21.18 arc45 31.74,21.33 31.69,21.33 29.67,21.33 arc45 29.13,21.11 29.1,21.08 29.09,21.07 arc45 28.87,20.53 28.87,17.77 arc45 28.96,17.56 28.97,17.55
  pour Top: 36.69,4.86 36.69,6.68 arc-45 36.84,7.04 36.96,7.16 arc-45 37.5,7.39 38.33,7.39 39.62,7.39 arc-45 40.11,7.18 40.11,6.74 arc-45 39.88,6.2 39.53,5.84 arc45 39.36,5.43 39.36,4.2 39.36,4.1 arc-45 39.32,4.01 arc-45 39.2,3.96 38.1,3.96 37.43,3.96 arc-45 36.89,4.18 36.74,4.33 arc-45 36.72,4.38 arc-45 36.69,4.44
  pour Top: 25.07,7.46 25.07,6.36 arc45 25.29,5.82 25.3,5.81 arc-45 25.78,4.65 25.78,3.79 arc-45 25.8,3.76 25.8,3.67 25.9,3.56 arc45 25.95,3.54 26.17,3.32 arc45 26.25,3.28 26.92,3.28 arc-45 26.95,3.27 26.95,5.09 arc45 26.87,5.28 26.19,5.96 arc45 26.17,5.97 25.84,6.3 arc-45 25.63,6.81 25.63,7.49 25.11,7.49 arc45 25.08,7.48
  pour Top: 29.87,6.75 arc-45 29.66,6.23 29.47,6.05 arc45 29.25,4.26 arc45 29.29,4.18 29.54,3.92 29.7,3.92 arc45 30.16,4.11 30.16,5.6 arc-45 30.24,5.79 30.41,5.95 arc45 30.48,6.13 30.48,8.07 arc45 30.47,8.1 29.87,8.07
+VIN  (via drill 0.35)
  Top 0.508: v32.04,13.05 31.19,13.05 R1.2
  Top 1.016: C31.2 C30.2 v12.59,4.26 13.48,4.26 IC1.4
  Bottom 0.508: 33.54,3.9 33.44,4 33.44,11.65 v32.04,13.05
  Bottom 1.524: v12.59,4.26 12.59,3.56 v12.84,3.31 13.43,3.9 33.54,3.9 40.02,3.9 v42.45,6.32 v43.08,6.95
  pour Top: 40.84,7.51 arc45 40.7,7.18 40.7,4 arc45 40.92,3.91 43.26,3.91 43.41,3.91 arc45 43.47,3.93 arc45 43.69,4.45 43.69,4.87 43.69,6.79 arc45 43.47,7.33 43.22,7.58 40.98,7.58 arc45 40.86,7.53
  pour Top: 11.27,3.28 11.74,3.28 arc-45 12.28,3.06 12.31,3.03 arc-45 12.33,3.02 12.42,2.93 arc45 12.61,2.85 12.79,2.85 13.12,2.85 arc45 13.49,3 13.95,3.47 arc45 14.17,4.01 14.17,4.26 14.17,4.62 arc45 14.11,4.77 arc45 13.87,4.87 12.83,4.87 arc-45 12.74,4.91 12.7,4.95 arc-45 12.47,5.49 12.47,5.49 12.47,5.99 12.39,6.07 arc45 12,6.23 11.6,6.23 arc45 11.29,6.1 arc45 11.16,5.8 11.16,3.35 11.21,3.3 arc45 11.25,3.28
+VSYS
  Top 0.152: 25.2,20.88 25.78,20.3 D2.1 26.95,18.85 Q3.2 | 25.2,20.88 C6.1 | C7.2 24,20.88 25.2,20.88
  Top 0.508: U1.4 28.36,22.3 29.95,23.89 U1.1
  pour Top: 28.14,17.55 28.14,21.09 arc-45 28.34,21.55 28.34,22.74 27.41,22.74 arc45 26.87,22.52 25.69,21.34 23.75,21.34 arc45 23.51,21.24 arc45 23.45,21.09 23.45,20.11 23.45,19.63 arc45 23.67,19.09 24.21,18.55 25.04,17.72 arc45 25.58,17.5 28.12,17.5 28.13,17.5 arc45 28.16,17.51
CHRG  (via drill 0.35)
  Top 0.152: IC1.7 18.61,6.85 18.3,7.16 18.3,18.82 19.81,20.33 23.05,20.33 25.26,18.12 26.3,18.12 v26.32,18.13 | R9.2 31.98,30.59 31.98,30.2 32.46,29.71 R7.2 34.67,27.94 v34.67,23.03
  Bottom 0.152: v34.67,23.03 34.67,23.02 33.53,21.87 30.05,21.87 v26.32,18.13
D+
  Top 0.152: R23.2 28.5,9.58 J3.B6 28.5,6.03 28.39,5.91 27.7,5.91 27.5,6.12 J3.A6
D-
  Top 0.152: J3.A7 28,8.52 | 28,8.52 28,9.61 R18.2 | J3.B7 27,8.44 27.08,8.52 28,8.52
DN
  Top 0.152: U3.40 35.61,36.75 35.94,37.08 38.58,37.08 39.1,36.56 39.1,18.82 32.53,12.24 28.6,12.24 28.08,11.72 28.08,11.14 R18.1
DP
  Top 0.152: R23.1 28.41,11.18 28.41,11.62 28.72,11.92 32.67,11.92 39.45,18.69 39.45,36.67 38.72,37.4 35.87,37.4 35.62,37.65 U3.41
GND  (via drill 0.35, 2 pad 3.2)
  Top 0.152: R36.2 30.63,15.65 v30.52,15.54
  Top 0.508: C9.2 33.41,27.64 33.64,27.4 33.64,22.55 v31.55,22.55 | v28.21,23.33 v28.2,23.34 28.99,24.13 28.99,24.68 U1.2
  other vias: 27.97,52.95 28.02,52.11 10.57,67.09 21.1,64.67 20.72,66.41 20.55,63.22 20.98,67.72 25.19,52.77 25.31,54.76 26.33,56.33 43.02,51.99 3.43,70.91 3.43,3.86 52.07,3.86 20.8,42.72 22.84,42.72 24.87,42.72 26.9,42.72 28.93,42.72 30.96,42.72 33,42.72 24.87,40.69 24.87,38.65 26.9,40.69 26.9,38.65 33,40.69 33,38.65 28.42,40.69 28.42,38.65 19.28,40.69 19.28,42.08 20.8,45.77 20.8,47.8 22.84,47.8 22.84,45.77 24.87,47.8 24.87,45.77 26.9,47.8 26.9,45.77 28.93,47.8 28.93,45.77 30.96,45.77 33,46.78 30.96,47.8 22.84,49.4 18.77,45.77 23.73,27.6 23.17,28.37 27.66,27.73 30.2,27.86 30.13,30.47 22.84,22.4 18.77,22.4 14.71,22.4 10.64,22.4 10.64,19.35 14.71,19.35 17.76,20.37 16.74,17.32 16.74,14.27 36.04,17.32 36.04,19.35 38.08,21.38 38.08,23.41 38.08,27.48 38.08,31.54 30.2,29.2 32.61,28.75 33.66,23.52 33.63,27.2 25.88,22.4 26.77,25.83 20.8,1.06 24.87,1.06 27.92,1.06 30.96,1.06 34.01,1.06 36.04,1.06 37.06,8.17 36.04,13.25 41.12,11.22 41.12,13.25 41.12,21.38 41.12,23.41 51.28,11.22 51.28,14.27 51.28,17.32 51.28,25.45 51.28,28.49 51.28,31.54 51.28,39.67 51.28,42.72 51.28,45.77 3.53,11.22 3.53,14.27 3.53,17.32 3.53,25.45 3.53,28.49 3.53,31.54 3.53,39.67 3.53,42.72 3.53,45.77 10.29,35.86 7.57,45.51 15.72,7.16 16.74,7.16 16.74,6.14 15.72,6.14 15.72,8.63 16.74,8.63 11.66,8.17 9.63,7.16 21.82,11.22 28.93,13 24.87,11.22 30.96,11.22 31.98,9.19 23.85,9.19 41.12,27.48 43.16,33.57 47.65,39.59 41.12,41.7 39.09,38.65 41.12,35.61 47.75,45.64 47.22,50.85 47.22,58.97 44.17,58.97 44.17,55.93 46.2,56.94 18.77,25.45 15.72,25.45 15.72,28.49 15.72,30.53 18.77,28.49 14.71,10.21 14.71,13.25 8.61,35.61 8.61,50.85 7.5,64.05 46.2,9.19 43.16,9.19 21.77,13.58 8.15,1.19 46.1,1.21 13.5,70.05 13.5,68.05 13.5,66.05 13.5,64.05 13.5,62.05 13.5,60.05 9.5,70.05 9.5,68.05 9.5,66.05 9.5,64.05 9.5,62.05 9.5,60.05 10.5,58.05 12,56.55 13.5,55.05 16.5,50.55 16.5,52.05 15,53.55 8.5,58.05 10,56.55 11.5,55.05 13,53.55 14.5,52.05 14.5,58.05 16,56.55 17.5,55.05 18.5,53.55 17.5,70.05 17.5,68.05 17.5,66.05 17.5,64.05 17.5,62.05 17.5,60.05 17.5,58.05 15.5,69.05 15.5,65.05 15.5,61.05 17.5,72.05 15.5,73.05 19.5,73.05 19.5,71.05 20.5,70.05 23.5,69.05 23.5,67.05 23.5,65.05 23.5,63.05 23.5,61.05 23.5,59.05 23.5,57.05 23.35,55.05 23.35,53.05 21.5,53.05 21.5,55.05 21.5,57.05 21.5,59.05 21.5,61.05 25.5,59.05 27.5,61.05 29.5,63.05 29.5,65.05 29.5,67.05 29.5,69.05 25.5,73.05 28.5,73.05 25.5,71.05 28.5,71.05 26.5,69.05 26.5,67.05 26.5,65.05 26.5,63.05 34.5,73.05 35.91,73.07 35.88,71.05 34.5,71.05 33.5,69.05 33.5,67.05 33.5,65.05 33.5,63.05 31.5,61.05 29.5,59.05 27.5,57.05 29.5,57.05 31.5,59.05 37.13,68.64 37.5,67.05 37.5,65.05 37.5,63.05 41.5,68.65 41.5,67.05 41.5,65.05 41.5,63.05 43.5,68.65 45.5,68.65 47.5,68.65 49.5,69.05 49.5,71.05 49.5,73.05 31.5,57.05 33.5,59.05 33.5,57.05 33.5,55.05 33.5,53.05 35.5,61.05 36.5,55.05 37.5,57.05 36.5,53.05 36.5,51.05 36.5,49.05 39.5,59.05 41.5,61.05 40.5,60.05 38.5,58.05 45.5,67.05 49.5,67.05 43.5,65.05 47.5,65.05 45.5,63.05 49.5,63.05 43.5,62.05 47.5,62.05 38.5,51.05 38.5,53.05 38.5,55.05 39.5,57.05 7.5,68.05 7.5,71.05 7.5,73.05 7.5,60.05 12.72,29.53 12.72,31.53 24.87,49.45 26.9,49.45 28.93,49.45 35.83,69.42 38.27,68.54
  pour Top (rank 2): -5.01,75.32 -5.01,-3.71 56.26,-3.71 56.26,75.32
  pour Bottom (rank 2): -4.99,75.5 -4.99,-3.68 56.28,-3.68 56.28,75.5
  cutout Top: 17.3,50.05 18.5,50.05 18.5,52.23 arc45 18.21,52.94 14.7,56.45 arc-45 12.5,61.76 12.5,71.45 11.1,71.45 11.1,62.81 arc45 14.32,55.02 17.01,52.34 arc-45 17.3,51.63
  cutout Top: 21.9,50.05 22.9,50.05 22.9,52.65 22.9,71.45 21.7,71.45 21.7,70.05 21.9,69.85
  cutout Top: 23.7,50.05 24.7,50.05 24.7,54.83 arc-45 24.99,55.54 32.01,62.55 arc45 32.3,63.26 32.3,71.45 30.9,71.45 30.9,63.66 arc-45 30.61,62.95 24.48,56.82 arc45 23.7,54.95
  cutout Top: 34.1,48.85 35.5,48.85 35.5,54.42 arc-45 37.5,59.25 40.27,62.01 arc45 40.9,63.54 40.9,70.45 39.5,70.45 39.5,63.46 arc-45 39.21,62.75 36.95,60.49 arc45 34.1,53.62
GND1
  cutout Bottom: 36.5,74 36.5,69.21 48.97,69.21 48.97,74
GND2
  cutout Top: 36.5,74 36.5,69.17 48.94,69.17 48.94,74
GND4
  cutout Bottom: 30.11,73.77 30.11,70.93 32.96,70.93 32.96,73.77
GND5
  cutout Bottom: 10.32,73.81 10.32,70.98 13.16,70.98 13.16,73.81
GND6
  cutout Top: 10.32,73.83 10.32,70.99 13.16,70.99 13.16,73.83
GND7  (via drill 2 pad 3.2)
  other vias: 52.07,70.91
GND8
  cutout Bottom: 20.87,73.74 20.87,70.91 23.71,70.91 23.71,73.74
GND9
  cutout Top: 20.87,73.75 20.87,70.92 23.71,70.92 23.71,73.75
GND10
  cutout Top: 30.11,73.77 30.11,70.94 32.96,70.94 32.96,73.77
LNA_CTL_P0.31  (via drill 0.35)
  Top 0.152: R10.2 20.25,59.99 v20.25,59.85 | U3.10 15.39,41.25 14.99,41.65 14.99,47.2 v15.12,47.34
  Bottom 0.152: v20.25,59.85 20.25,49.7 17.89,47.34 v15.12,47.34
LR_DIO7
  Top 0.152: U3.24 R12.2
LR_DIO8
  Top 0.152: U3.23 21.52,30.24 P1.P$1
LR_DIO9  (via drill 0.35)
  Top 0.152: R11.2 v17.92,31.18 v17.92,31.19 | v17.52,40.38 17.49,40.35 U3.11
  Bottom 0.152: v17.52,40.38 19.59,38.31 19.59,34.72 17.92,33.05 v17.92,31.19
N$1
  Top 0.508: R22.1 23.68,14.26 LED2.+
N$2
  Top 0.463: U3.54 34.81,54.19 arc-45 37.01,59.48 39.72,62.19 arc45 40.12,63.16 L12.1
N$3
  Top 0.156: 31.59,65.6 arc45 C5.1 | 31.59,66.56 arc-45 L3.1
  Top 0.463: L2.2 31.59,65.6 | C5.1 31.59,66.56
N$4
  Top 0.463: L3.2 31.53,68.66 C13.1 ANT2.P$1
N$5
  Top 0.463: U3.65 24.21,54.59 arc-45 24.95,56.36 31.15,62.56 arc45 31.59,63.62 L2.1
N$6
  Top 0.152: J3.B5 29.5,9.47 R24.2
N$7  (via drill 0.35)
  Top 0.152: LED3.- 32.7,15.16 32.7,18.65 33.38,19.32 v33.96,19.32 | R8.1 R7.1 35.28,28.23 35.28,22.35 v34.96,22.03
  Bottom 0.152: v33.96,19.32 33.96,21.01 34.96,22.01 v34.96,22.03
N$8
  Top 0.152: 22.41,63.63 arc-45 R2.1
  Top 0.463: 22.41,63.63 22.41,62.66 | C55.1 22.41,62.66 | U3.67 22.39,50.98 22.39,62.61 arc-45 22.41,62.66
N$9
  Top 0.463: R16.1 11.82,62.49 arc45 14.75,55.43 17.3,52.88 arc-45 17.91,51.39 U3.72
N$10
  Top 0.508: R3.1 27,14.25 LED1.+
N$11
  Top 0.508: R1.1 LED3.+
N$12
  Top 0.152: J3.A5 26.5,9.77 R25.1
N$13
  Top 0.762: U1.3 28.03,24.72 L4.1
N$14
  Top 0.463: L5.1 11.81,65.66 C14.2 R16.2
N$15
  Top 0.508: R15.2 13.43,6.95 IC1.2
N$16
  Top 0.463: ANT4.P$1 11.8,70.8 C16.2 11.8,67.63 L5.2
N$17
  Top 0.254: Q1.3 18.87,64.48 R13.1 18.53,65.41 Q4.1
N$18
  Top 0.152: R10.1 R27.2 18.56,61.67 Q1.1
N$19
  Top 0.508: IC1.6 18.38,5.58 18.04,5.24 18.04,3.71 19.1,2.65 R5.1
N$20
  Top 0.508: U1.5 29.95,22.76 30.68,23.48 R17.1 32.68,23.48 R19.2
N$27
  Top 0.508: Q4.3 19.54,68.07 C33.2 19.57,68.66 L7.1
N$54
  Top 0.463: R2.2 C17.1 C53.2
N$63
  Top 0.463: L14.1 40.15,66.67 C60.1 40.12,65.62 L12.2
N$104
  Top 0.463: ANT1.P$1 40.13,72.89 C11.1 40.12,68.61 L14.2
P0.00/XL1
  Top 0.152: U3.29 26.92,31.59 27.25,31.26 C15.1 27.28,30.6 27.28,30.3 26.51,29.53 Y2.2
P0.01/XL2
  Top 0.152: U3.30 27.82,31.71 28.27,31.25 C61.1 28.31,30.6 28.31,30.25 29.01,29.54 Y2.1
P0.02
  Top 0.152: U3.12 14.86,39.45 14.44,39.87 14.44,49.63 5.03,59.04 5.03,60.42 J9.3
P0.03
  Top 0.152: U3.13 14.81,38.55 13.99,39.37 13.99,49.22 3.73,59.48 J9.4
P0.04/AIN2  (via drill 0.35)
  Top 0.152: U3.31 28.71,33.3 v29.01,33.59 | J7.1 42.52,31.38 v42.47,31.43
  Bottom 0.152: v29.01,33.59 40.31,33.59 v42.47,31.43
P0.05/AIN3  (via drill 0.35)
  Top 0.152: U3.17 16.96,34.95 17.71,34.2 v29.78,34.2 | J7.2 43.41,29.37 v43.33,29.45
  Bottom 0.152: v29.78,34.2 40.86,34.2 43.13,31.93 43.13,29.65 v43.33,29.45
P0.06
  Top 0.152: U3.32 29.67,32.4 29.67,31.67 30.14,31.19 32.34,31.19 R8.2
P0.07
  Top 0.152: U3.19 17.91,33.21 17.83,33.29 15.62,33.29 10.7,38.22 8.71,38.22 7.72,39.21 7.72,41.96 8.26,42.49 12.5,42.49 13.13,43.12 13.13,48.64 7.5,54.27 7.27,54.4 J9.6
P0.08/D2  (via drill 0.35)
  Top 0.152: U3.33 30.52,34.47 30.16,34.82 v18.63,34.82 | J4.2 13.53,27.37 13.98,27.82 13.98,31.9 14.52,32.43 v16.39,32.43
  Bottom 0.152: v18.63,34.82 18.63,34.7 16.39,32.46 v16.39,32.43
P0.11
  Top 0.152: U3.25 23.32,30.69 R12.1
P0.12/D2  (via drill 0.35)
  Top 0.152: J4.1 13.69,25.37 14.48,26.16 14.48,31.53 14.75,31.8 v14.77,31.8 | U3.35 32.31,33.85 30.73,35.43 17.86,35.43 v17.82,35.39
  Bottom 0.152: v17.82,35.39 17.82,34.87 14.77,31.82 v14.77,31.8
P0.13/SDA_0  (via drill 0.35)
  Top 0.152: J6.2 7.7,13.27 6.92,14.05 6.92,30.63 8.84,32.54 v11.29,32.54 | v18.62,37.29 32.02,37.29 33.46,35.85 U3.39 37.17,35.85 R20.1
  Bottom 0.152: v11.29,32.54 11.29,34.95 13.64,37.29 v18.62,37.29
P0.14/SCL_0  (via drill 0.35)
  Top 0.152: J6.1 8.4,11.27 6.55,13.11 6.55,30.85 9.06,33.36 v11.96,33.36 v11.97,33.36 | v17.81,36.68 18.05,36.68 31.84,36.68 33.56,34.95 U3.38 37.02,34.95 R21.1
  Bottom 0.152: v11.97,33.36 11.97,34.73 13.92,36.68 v17.81,36.68
P0.15  (via drill 0.35)
  Top 0.152: v35.97,38.53 35.95,38.55 U3.42 | v39.24,42.63 39.24,44.99 48.66,54.4 J12.6
  Bottom 0.152: v35.97,38.53 39.24,41.8 v39.24,42.63
P0.16  (via drill 0.35)
  Top 0.152: U3.26 24.24,32.47 24.24,33.15 24.68,33.59 v27.86,33.59 | R9.1 31.08,30.6 v31.08,29.76
  Bottom 0.152: v27.86,33.59 28.44,33.01 28.72,33.01 28.76,32.98 29.45,32.98 31.09,31.34 31.09,29.76 v31.08,29.76
P0.17  (via drill 0.35)
  Top 0.152: v38.59,43.45 38.59,45.11 50.43,56.94 J12.5 | U3.43 35.96,39.45 v35.97,39.44
  Bottom 0.152: v35.97,39.44 38.59,42.07 v38.59,43.45
P0.18/NRESET  (via drill 0.35)
  Top 0.152: v12.73,34.09 9.12,34.09 6.12,31.09 6.12,12.67 7.13,11.66 7.13,5.42 9.87,2.67 11.14,2.67 11.56,2.26 R4.1 | U3.36 33.24,32.47 33.24,34.14 31.3,36.08 18.65,36.08 v18.63,36.05 | C18.1 11.58,1.93 R4.1 | R4.1 13.3,1.95 K1.2
  Bottom 0.152: v18.63,36.05 14.69,36.05 v12.73,34.09
P0.20  (via drill 0.35)
  Top 0.152: v37.96,44.29 37.96,45.11 50.22,57.36 50.22,58.99 50.71,59.48 J12.4 | U3.45 35.96,41.25 v35.99,41.28
  Bottom 0.152: v37.96,44.29 37.96,43.25 v35.99,41.28
P0.21
  Top 0.152: U3.49 36.88,44.85 49.68,57.65 49.68,60.36 51.34,62.02 J12.3
P0.22/UART_RXD
  Top 0.152: J10.1 47.19,17.27 48.12,18.21 48.12,31.17 37.14,42.15 U3.46
P0.23/QSPI_IO3
  Top 0.152: U4.7 30.66,54.6 30.28,54.22 30.28,53.38 29.61,52.72 U3.59
P0.24/UART_TXD
  Top 0.152: J10.2 47.37,15.27 48.47,16.37 48.47,31.49 36.9,43.05 U3.47
P0.25
  Top 0.152: U3.52 35.46,47.55 35.85,47.17 37.27,47.17 40.41,50.31 40.41,58.62 42.22,60.43 48.34,60.43 52.07,64.16 J12.2
P0.26/D1
  Top 0.152: U3.18 15.69,34.05 12.37,37.37 12.37,39.06 11.84,39.59 J2.1
P0.27/D1
  Top 0.152: J2.2 11.88,41.59 13.03,40.44 13.03,37.52 14.7,35.85 U3.16
P0.28/AIN4  (via drill 0.35)
  Top 0.152: U3.14 17.29,37.65 18.12,38.49 18.12,42.59 19.34,43.81 32.44,43.81 33.25,44.62 v33.25,44.79 | J1.1 43.11,45.59 v43.08,45.56
  Bottom 0.152: v33.25,44.79 34.02,45.56 v43.08,45.56
P0.29/AIN5  (via drill 0.35)
  Top 0.152: U3.9 16.98,42.15 19.03,44.2 32.03,44.2 v32.03,44.41 v32.02,44.42 | v43.1,43.76 43.23,43.63 43.78,43.63 J1.2
  Bottom 0.152: v32.02,44.42 32.18,44.42 32.41,44.18 33.18,44.18 33.19,44.18 34.35,44.18 35.25,45.08 41.79,45.08 v43.1,43.76
P0.30
  Top 0.152: U3.15 16.3,36.74 14.9,36.74 13.58,38.05 13.58,48.84 5.48,56.94 J9.5
P1.00/USER_KEY
  Top 0.152: U3.48 36.68,43.95 48.87,31.76 48.87,8.55 43.92,3.6 R6.1 | C19.1 43.92,1.27 R6.1 | R6.1 42.29,2.2 K2.2
P1.01/QSPI_IO2
  Top 0.152: U4.3 27.11,53.72 28.11,53.72 28.71,53.11 U3.60
P1.02/QSPI_IO0
  Top 0.152: U4.5 30.99,53 30.51,52.53 U3.58
P1.03/QSPI_IO1
  Top 0.152: U4.2 26.8,54.6 26.35,54.15 26.35,52.76 27.82,51.29 U3.61
P1.04/QSPI_SCK
  Top 0.152: U4.6 31.38,53.8 31.68,53.5 31.68,52.04 31.41,51.78 U3.57
P1.05/QSPI_CS
  Top 0.152: U4.1 26.84,55.4 26.03,54.59 26.03,52.42 26.91,51.53 U3.62
P1.08
  Top 0.152: U3.20 18.82,30.35 R11.1
P1.09/LED  (via drill 0.35)
  Top 0.152: U3.34 31.39,32.43 31.39,31.72 31.59,31.52 34.75,31.52 35.66,30.6 35.66,21.67 35.22,21.23 v32.95,21.23
  Top 0.254: LED2.- 25.22,14.26 v26.07,14.26
  Bottom 0.152: v26.07,14.26 26.07,16.42 30.89,21.23 v32.95,21.23
RF_GPS
  Top 0.463: ANT3.P$1 22.37,70.7 L7.2 C53.1
SWDCLK
  Top 0.152: U3.51 34.95,46.78 37.49,46.78 40.92,50.21 40.92,57.77 41.76,58.61 J8.P$4
SWDIO
  Top 0.152: J8.P$3 41.4,56.72 41.4,50.01 37.15,45.75 U3.50
VDD_NRF
  Top 0.5: 24.94,31.17 24.94,31.39 | U3.27 25.11,31.56 24.94,31.39 | U3.28 26.02,31.6 25.68,31.27 25.06,31.27 24.94,31.39
  Top 0.8: FB1.1 24.95,26.19 C1.1 24.95,28.55 C2.1 C10.1 24.94,31.17
VDD_RADIO
  Top 0.5: 20.61,31.13 U3.22 | U3.21 19.71,31.74 20.61,30.85 20.64,30.82
  Top 0.8: FB2.1 22.55,25.64 C3.1 21.78,25.77 21.45,26.1 21.42,28.38 20.62,29.17 20.62,29.42 C12.1 20.64,29.46 C4.1 20.64,30.82 | 20.61,30.85 20.61,31.13

### Text on the board
tPlace: GND | GND | GND | 25 | 02 | 21 | SWDCLK | 03 | 20 | 30 | SWDIO | 17 | GND | 07 | 15 | 3V3 | 3V3 | 3V3 | GND | 28 | 29 | 3V3 | 3V3 | 27 | GND | 26 | GND | 04 | 05 | 3V3 | 3V3 | 08 | GND | 12 | GND | 22 / RXD | 3V3 | 24 / TXD | 13 / SDA | 3V3 | CHR | - | + | USER | PWR | - | + | GND | 14 / SCL | + | -
bPlace: LoRa Node Module_V1.0
tNames: ANT2 | ANT1 | ANT4 | ANT3
201bmp: D:/OneDrive/图片/WIFI.bmp